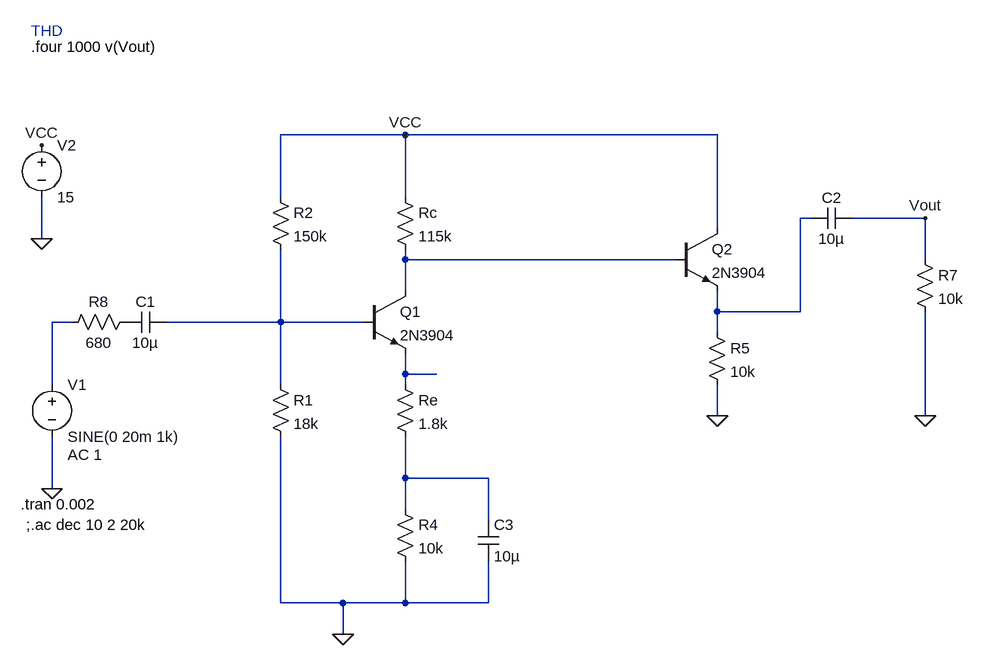
[diagram p0: schematic npn_2n3904_amplifier_circuit.asc]
npn_2n3904_amplifier_circuit.asc, the LTspice schematic file:
Version 4
SHEET 1 1076 680
WIRE 208 -128 16 -128
WIRE 688 -128 208 -128
WIRE 16 -32 16 -128
WIRE 208 -32 208 -128
WIRE 832 0 816 0
WIRE 1008 0 896 0
WIRE 688 16 688 -128
WIRE -352 32 -352 -32
WIRE 208 64 208 48
WIRE 624 64 208 64
WIRE 1008 64 1008 0
WIRE 208 112 208 64
WIRE 688 144 688 112
WIRE 816 144 816 0
WIRE 816 144 688 144
WIRE -304 160 -336 160
WIRE 16 160 16 48
WIRE 16 160 -160 160
WIRE 144 160 16 160
WIRE 688 176 688 144
WIRE 208 240 208 208
WIRE 256 240 208 240
WIRE -336 256 -336 160
WIRE 16 256 16 160
WIRE 208 256 208 240
WIRE 688 304 688 256
WIRE 1008 304 1008 144
WIRE 208 400 208 336
WIRE 336 400 208 400
WIRE -336 416 -336 336
WIRE 208 448 208 400
WIRE 336 464 336 400
WIRE 16 592 16 336
WIRE 112 592 16 592
WIRE 208 592 208 528
WIRE 208 592 112 592
WIRE 336 592 336 528
WIRE 336 592 208 592
WIRE 112 640 112 592
FLAG -336 416 0
FLAG -352 32 0
FLAG -352 -112 VCC
FLAG 208 -128 VCC
FLAG 112 640 0
FLAG 688 304 0
FLAG 1008 304 0
FLAG 1008 0 Vout
DATAFLAG 16 160 "round($*1000)/1000"
DATAFLAG 272 64 "round($*100)/100"
DATAFLAG 256 240 "round(1000*$)/1000"
DATAFLAG 16 -128 ""
DATAFLAG 336 320 "round(I(Re)*100000)/100000"
SYMBOL npn 144 112 R0
SYMATTR InstName Q1
SYMATTR Value 2N3904
SYMBOL res 0 -48 R0
SYMATTR InstName R2
SYMATTR Value 150k
SYMBOL res 0 240 R0
SYMATTR InstName R1
SYMATTR Value 18k
SYMBOL res 192 -48 R0
SYMATTR InstName Rc
SYMATTR Value 115k
SYMBOL res 192 240 R0
SYMATTR InstName Re
SYMATTR Value 1.8k
SYMBOL cap -160 144 R90
WINDOW 0 0 32 VBottom 2
WINDOW 3 32 32 VTop 2
SYMATTR InstName C1
SYMATTR Value 10µ
SYMBOL voltage -336 240 R0
WINDOW 123 24 124 Left 2
WINDOW 39 0 0 Left 0
SYMATTR Value2 AC 1
SYMATTR InstName V1
SYMATTR Value SINE(0 20m 1k)
SYMBOL voltage -352 -128 R0
WINDOW 123 24 44 Left 2
WINDOW 39 0 0 Left 0
SYMATTR InstName V2
SYMATTR Value 15
SYMBOL res 192 432 R0
SYMATTR InstName R4
SYMATTR Value 10k
SYMBOL cap 320 464 R0
SYMATTR InstName C3
SYMATTR Value 10µ
SYMBOL npn 624 16 R0
SYMATTR InstName Q2
SYMATTR Value 2N3904
SYMBOL res 672 160 R0
SYMATTR InstName R5
SYMATTR Value 10k
SYMBOL res 992 48 R0
SYMATTR InstName R7
SYMATTR Value 10k
SYMBOL cap 896 -16 R90
WINDOW 0 0 32 VBottom 2
WINDOW 3 32 32 VTop 2
SYMATTR InstName C2
SYMATTR Value 10µ
SYMBOL res -208 144 R90
WINDOW 0 0 56 VBottom 2
WINDOW 3 32 56 VTop 2
SYMATTR InstName R8
SYMATTR Value 680
TEXT -384 440 Left 2 !.tran 0.002
TEXT -368 -264 Left 2 !.four 1000 v(Vout)
TEXT -368 -288 Left 2 ;THD
TEXT -376 472 Left 2 !;.ac dec 10 2 20k

The netlist it stands for:
* npn_2n3904_amplifier_circuit.asc
Q1 N002 N004 N005 0 2N3904
R2 VCC N004 150k
R1 N004 0 18k
Rc VCC N002 115k
Re N005 N006 1.8k
C1 N004 P001 10µ
V1 N003 0 SINE(0 20m 1k) AC 1
V2 VCC 0 15
R4 N006 0 10k
C3 N006 0 10µ
Q2 VCC N002 N001 0 2N3904
R5 N001 0 10k
R7 Vout 0 10k
C2 Vout N001 10µ
R8 P001 N003 680
.model NPN NPN
.model PNP PNP
.lib standard.bjt
.tran 0.002
.four 1000 v(Vout)
* THD
;.ac dec 10 2 20k
.backanno
.end